# EAGLE design interstage_B1 (EAGLE 9.6.0)
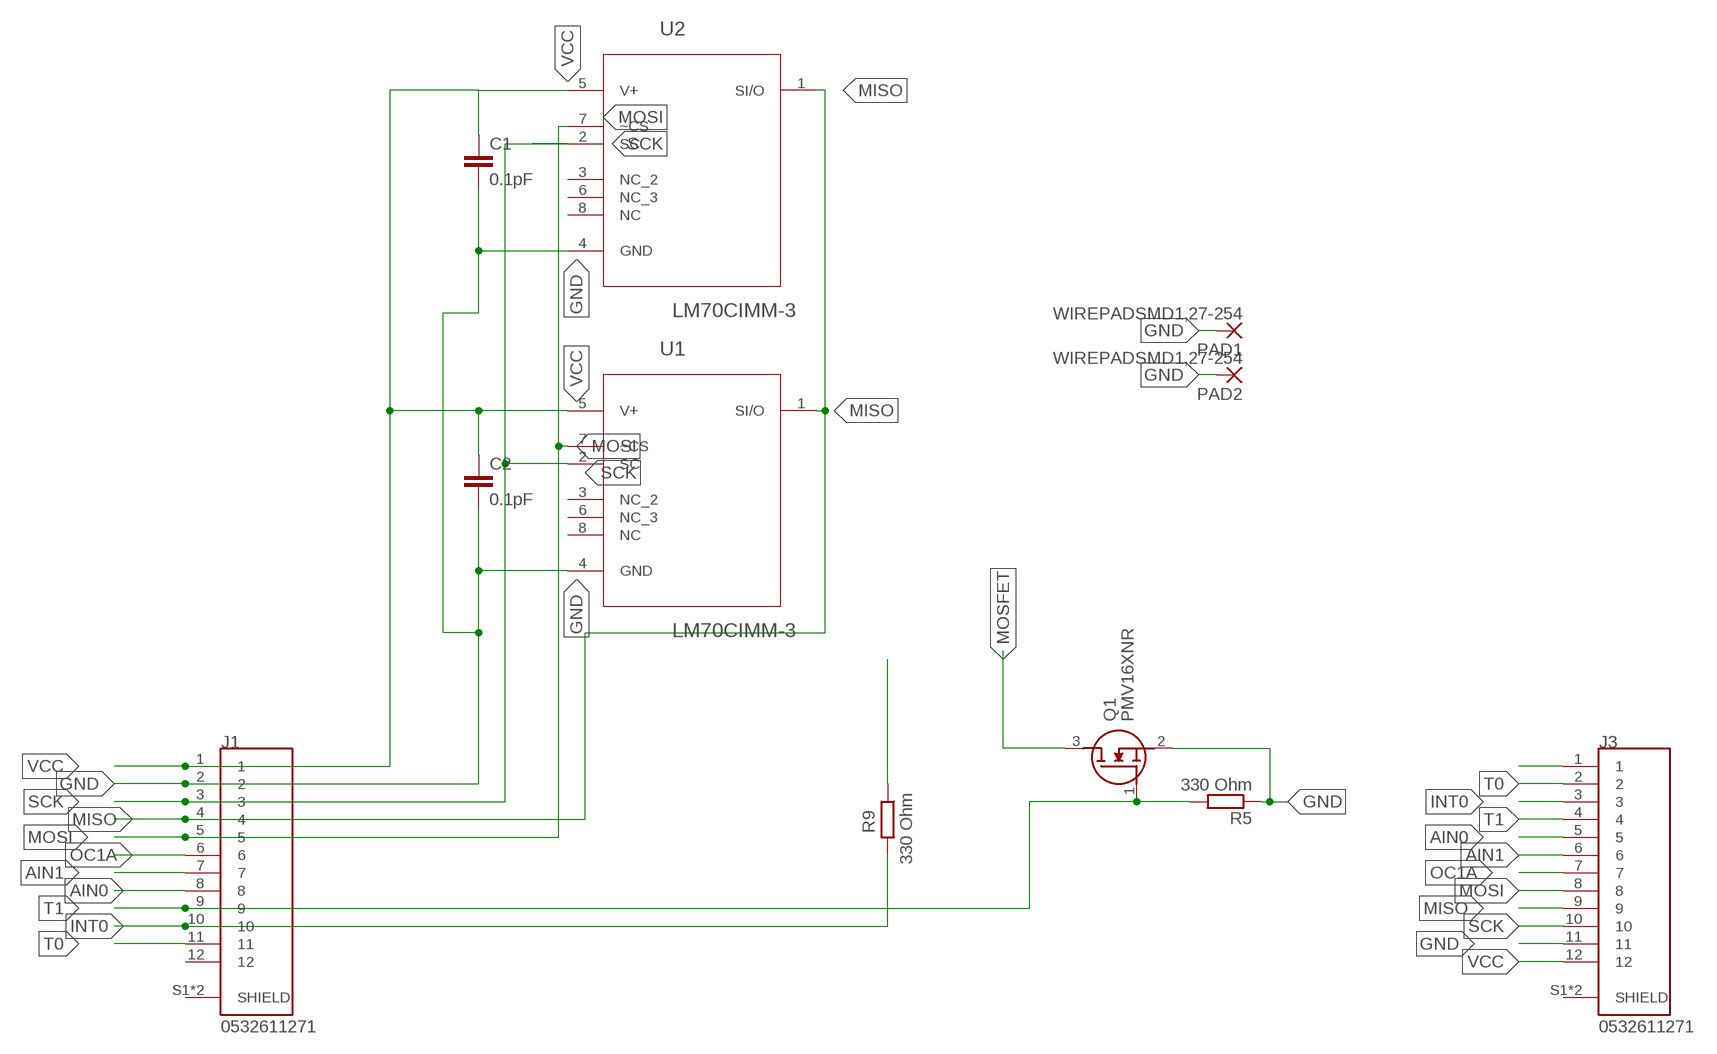
[diagram p0: schematic, sheet 1]

## Parts
C1  0.1pF  C-EUC0603K  [C0603K]
C2  0.1pF  C-EUC0603K  [C0603K]
J1  0532611271  [MOLEX_0532611271]
J3  0532611271  [MOLEX_0532611271]
PAD1  WIREPADSMD1,27-254  [SMD1,27-2,54]
PAD2  WIREPADSMD1,27-254  [SMD1,27-2,54]
Q1  PMV16XNR  [SOT95P230X110-3N]
R5  330 Ohm  R-EU_R1206  [R1206]
R9  330 Ohm  R-EU_R1206  [R1206]
U1  LM70CIMM-3  [SOP65P490X110-8N]
U2  LM70CIMM-3  [SOP65P490X110-8N]

## Nets
AIN0: J1.8 J3.5
AIN1: J1.7 J3.6
GND: C1.2 C2.2 J1.2 J3.11 PAD1.1(P) PAD2.1(P) Q1.2(S) R5.1 U1.4(GND) U2.4(GND)
INT0: J1.10 J3.3 R9.2
MISO: J1.4 J3.9 U1.1(SI/O) U2.1(SI/O)
MOSFET: Q1.3(D)
MOSI: J1.5 J3.8 U1.7(~CS) U2.7(~CS)
N$3: J3.1
N$4: R9.1
OC1A: J1.6 J3.7
SCK: J1.3 J3.10 U1.2(SC) U2.2(SC)
T0: J1.11 J3.2
T1: J1.9 J3.4 Q1.1(G) R5.2
VCC: C1.1 C2.1 J1.1 J3.12 U1.5(V+) U2.5(V+)
Unconnected: J1.12 J1.S1(SHIELD) J1.S2(SHIELD) J3.S1(SHIELD) J3.S2(SHIELD) U1.3(NC_2) U1.6(NC_3) U1.8(NC) U2.3(NC_2) U2.6(NC_3) U2.8(NC)

## Library data of the parts
C1 C2 = rcl:C-EU: CAPACITOR, European symbol; SPICEPREFIX: C
J1 J3 = picoblade:0532611271: Conn Shrouded Header HDR 12 POS 1.25mm Solder RA SMD PicoBlade; AVAILABILITY: Unavailable; DESCRIPTION: Picoblade Connector, 12 Circuit Single Row, Right Angle Surface Mount SMT PCB; MF: Molex; MP: 0532611271; PACKAGE: None; PRICE: None
PAD1 PAD2 = wirepad:WIREPAD: Wire PAD connect wire on PCB
Q1 = SamacSys_Parts:PMV16XNR: Nexperia PMV16XNR N-channel MOSFET, 8.6 A, 20 V PMV16XN, 3-Pin SOT-23 Source: Datasheet <https://componentsearchengine.com/Datasheets/1/PMV16XNR.pdf>; DESCRIPTION: Nexperia PMV16XNR N-channel MOSFET, 8.6 A, 20 V PMV16XN, 3-Pin SOT-23; HEIGHT: 1.1mm; MANUFACTURER_NAME: Nexperia; MANUFACTURER_PART_NUMBER: PMV16XNR; MOUSER_PART_NUMBER: 771-PMV16XNR; MOUSER_PRICE-STOCK: https://www.mouser.com/Search/Refine.aspx?Keyword=771-PMV16XNR
R5 R9 = rcl:R-EU_: RESISTOR, European symbol; SPICEPREFIX: R
U1 U2 = LM70CIMM-3:LM70CIMM-3: 10-Bit plus Sign Digital Temperature Sensor; AVAILABILITY: Unavailable; DESCRIPTION: Temperature Sensor Digital, Local -55°C ~ 150°C 10 b 8-VSSOP; MF: Texas Instruments; MP: LM70CIMM-3/NOPB; PACKAGE: MSOP-8 Texas Instruments; PRICE: None

## Board
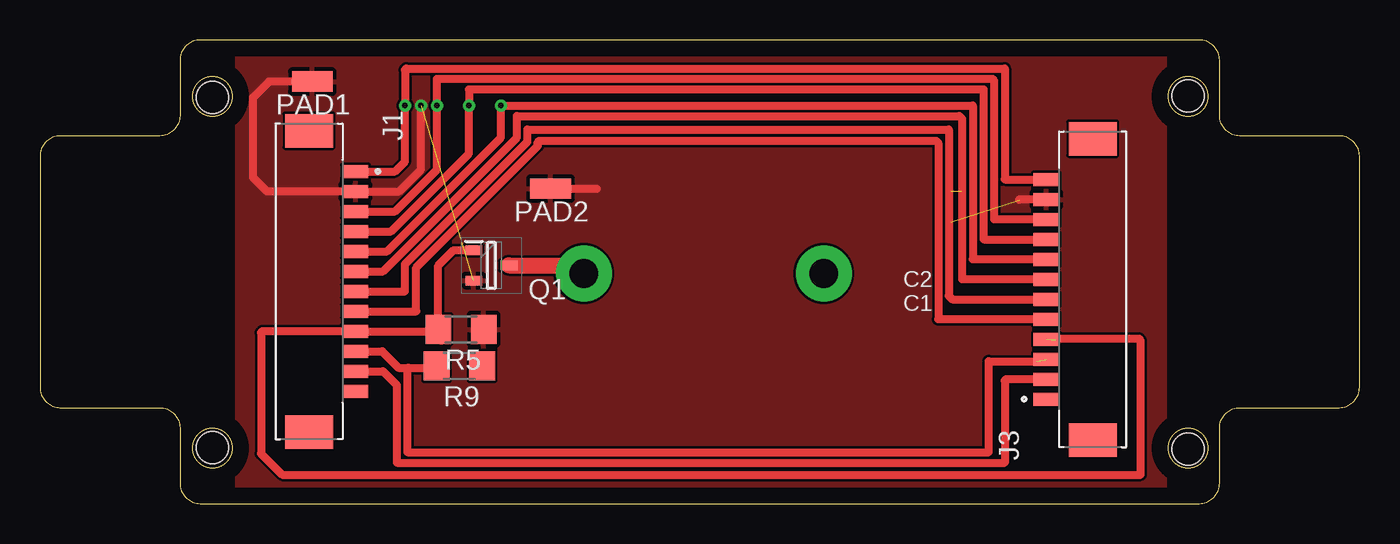
[diagram p1: board, top side]
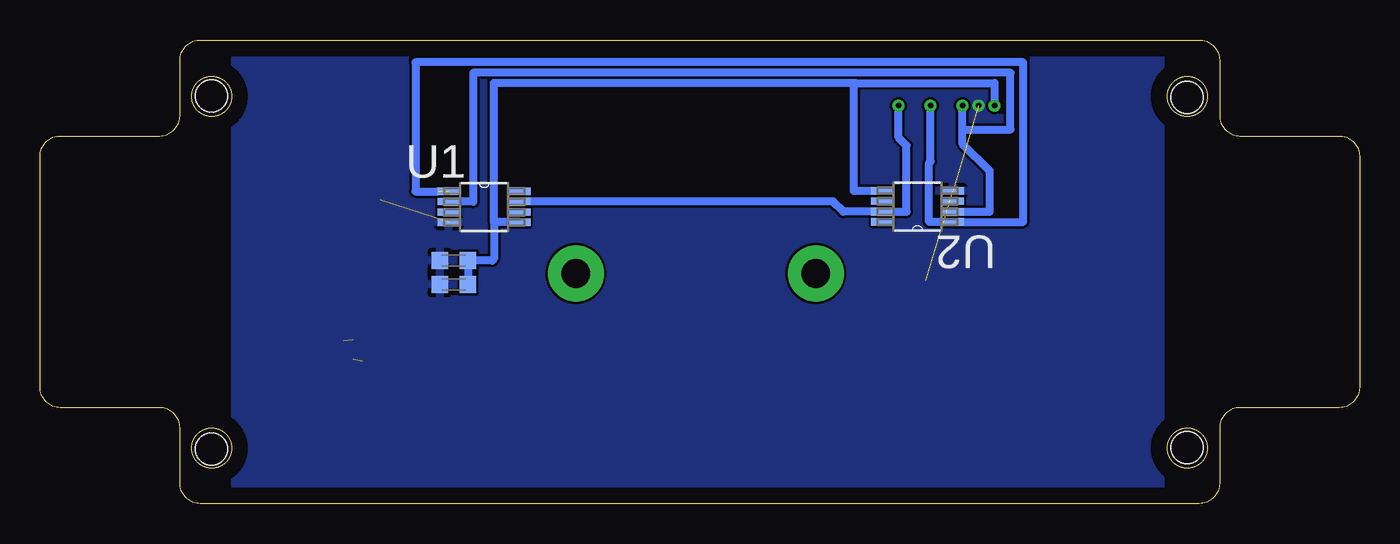
[diagram p2: board, bottom side, seen from below]

Size 82.5 x 29 mm. Coordinates in mm from the lower left corner, seen from the top.
Outline: 0,7.27 arc90 1.27,6 7.48,6 arc-90 8.75,4.73 8.75,1.27 arc90 10.02,0 72.48,0 arc90 73.75,1.27 73.75,4.73 arc-90 75.02,6 81.23,6 arc90 82.5,7.27 82.5,21.73 arc90 81.23,23 75.02,23 arc-90 73.75,24.27 73.75,27.73 arc90 72.48,29 10.02,29 arc90 8.75,27.73 8.75,24.27 arc-90 7.48,23 1.27,23 arc90 0,21.73 0,7.27
Outline: circle at 71.78,25.47 radius 1.25
Outline: circle at 10.78,3.48 radius 1.25
Outline: circle at 10.78,25.47 radius 1.25
Outline: circle at 71.78,3.48 radius 1.25
Copper layers (1*16): Top 0.035mm / dielectric 1.5mm / Bottom 0.035mm
Design rules "default": minimum track width 6mil, minimum drill 0.35mm, track to track 6mil, track to pad 6mil, pad to pad 6mil, via to via 6mil, smd to smd 6mil, copper to edge 40mil, drill to drill 6mil, minimum pad ring 10mil, minimum via ring 8mil, stop-mask expansion 4mil, vias tented up to drill 0mil, thermal gap 10mil
Holes 2 mm at 10.77,3.5 10.77,25.4 71.77,3.4 71.77,25.5

### Footprints (pad centres in the part's own frame; a part is rotated, then mirrored left to right if it is on the bottom)
C0603K = smd 1.05 x 1.08: 1 -0.875,0; 2 0.875,0
MOLEX_0532611271 = smd 0.8 x 1.6: 1 -6.875,2.9; 2 -5.625,2.9; 3 -4.375,2.9; 4 -3.125,2.9; 5 -1.875,2.9; 6 -0.625,2.9; 7 0.625,2.9; 8 1.875,2.9; 9 3.125,2.9; 10 4.375,2.9; 11 5.625,2.9; 12 6.875,2.9 | smd 2.1 x 3: S1 -9.425,0; S2 9.425,0
SMD1,27-2,54 = smd 1.27 x 2.54: 1 0,0
SOT95P230X110-3N = smd 1.05 x 0.6: 1 -1.1,0.95; 2 -1.1,-0.95; 3 1.1,0
R1206 = smd 1.6 x 1.803: 1 -1.422,0; 2 1.422,0
SOP65P490X110-8N = smd 1.372 x 0.457: 1 -2.21,0.965; 2 -2.21,0.33; 3 -2.21,-0.33; 4 -2.21,-0.965; 5 2.21,-0.965; 6 2.21,-0.33; 7 2.21,0.33; 8 2.21,0.965

### Placement (x,y rotation side)
C1  56.62,13.7 180 bottom
C2  56.62,15.2 180 bottom
J1  16.82,13.9 270 top
J3  65.82,13.4 90 top
PAD1  17.02,26.4 90 top
PAD2  31.92,19.7 90 top
Q1  28.22,14.9 0 top
R5  26.32,10.9 180 top
R9  26.22,8.6 180 top
U1  54.73,18.56 0 bottom
U2  27.64,18.59 180 bottom

### Tracks (layer width: path | path; a pad name or v marks a point on that pad's centre or on a via)
AIN0
  Top 0.5: 19.59,11.9 J1.8 23.52,12.03 23.52,14.76 31.12,22.36 31.12,22.6 31.23,22.7 56.02,22.7 56.17,22.55 56.17,11.53 J3.5 63.05,11.65
AIN1
  Top 0.5: J3.6 57.05,12.78 56.82,13 56.82,23.4 30.47,23.4 30.47,22.63 22.82,14.98 22.82,13.28 J1.7
GND  (via drill 0.35)  (3 unrouted)
  Top 0.5: v23.82,24.9 23.82,20.9 22.45,19.52 J1.2 14.2,19.52 13.32,20.4 13.32,25.4 14.32,26.4 PAD1.1 | PAD2.1 34.82,19.7 | J3.11 61.24,19.02 61.22,19
  pour Top: 12.32,27.9 12.32,0.4 70.32,0.4 70.32,27.9
  pour Bottom: 12.42,27.9 70.32,27.9 70.32,0.4 12.42,0.4
INT0  (1 unrouted)
  Top 0.5: 62.32,8.9 59.32,8.9 59.32,3.21 22.97,3.21 22.97,8.45 23.02,8.5 | J1.10 21.39,9.53 22.42,8.5 23.02,8.5 | 23.02,8.5 24.7,8.5 R9.2
MISO  (via drill 0.35)  (1 unrouted)
  Top 0.5: 19.59,16.9 J1.4 21.95,17.02 26.82,21.9 v26.82,24.9 26.82,25.9 59.02,25.9 59.02,16.52 J3.9
  Bottom 0.5: U2.1 25.09,17.62 | U2.1 26.92,17.62 26.92,21.3 26.82,21.4 v26.82,24.9 | U2.1 21.02,17.62 21.02,27.6 59.02,27.6 59.02,19.52 57.62,19.52
MOSFET  (via drill 1.8 pad 3.5)
  Top 1: Q1.3 33.5,14.9 v34,14.4
MOSI  (via drill 0.35)
  Top 0.5: J3.8 58.32,15.28 58.32,24.9 v28.82,24.9 28.82,22.9 21.7,15.78 J1.5
  Bottom 0.5: v28.82,24.9 28.82,22.9 28.32,22.4 28.32,18.26 U2.7 32.28,18.26 32.91,18.89 U1.7
N$2  (via drill 1.8 pad 3.5)
  other vias: 49,14.4
OC1A
  Top 0.5: 19.84,14.4 J1.6 21.45,14.53 29.82,22.9 29.82,24.25 57.47,24.25 57.67,24.05 57.67,14.03 J3.7 62.8,13.9
SCK  (via drill 0.35)
  Top 0.5: J3.10 59.67,17.77 59.67,26.45 59.57,26.55 24.82,26.55 v24.82,24.9 24.82,20.9 22.2,18.27 J1.3
  Bottom 0.5: 56.97,18.86 U1.2 55.42,18.89 55.42,26.95 21.82,26.95 21.82,23.4 24.82,23.4 | U2.2 23.12,18.26 23.12,20.8 24.82,22.5 24.82,23.4 | 24.82,23.4 v24.82,24.9
T0
  Top 0.5: J1.11 21.45,8.28 22.32,7.4 22.32,2.55 60.32,2.55 60.32,7.7 60.4,7.78 J3.2 62.8,7.9
T1  (1 unrouted)
  Top 0.5: 24.9,10.4 R5.2 24.9,14.88 25.87,15.85 Q1.1 | 24.9,10.4 24.52,10.78 J1.9 13.89,10.78 13.82,10.7 13.82,3.12 15.14,1.8 68.82,1.8 68.82,10.2 68.72,10.3 63.62,10.3 63.52,10.2 | 24.9,10.4 25.1,10.2 | 62.8,10.4 J3.4
VCC  (via drill 0.35)
  Top 0.5: J3.12 60.32,20.27 60.32,27.2 60.31,27.2 22.89,27.2 22.82,27.13 v22.82,24.9 22.82,21.4 22.2,20.77 J1.1
  Bottom 0.5: 31.52,26.3 31.62,26.2 31.62,19.55 U2.5 | v22.82,24.9 22.82,26.3 31.52,26.3 | 31.52,26.3 54.12,26.3 54.12,17.59 | U1.5 54.12,17.59 | C1.1 C2.1 54.22,15.2 54.12,15.3 54.12,17.59